# Altium schematic sheet Externos.SchDoc
size A4
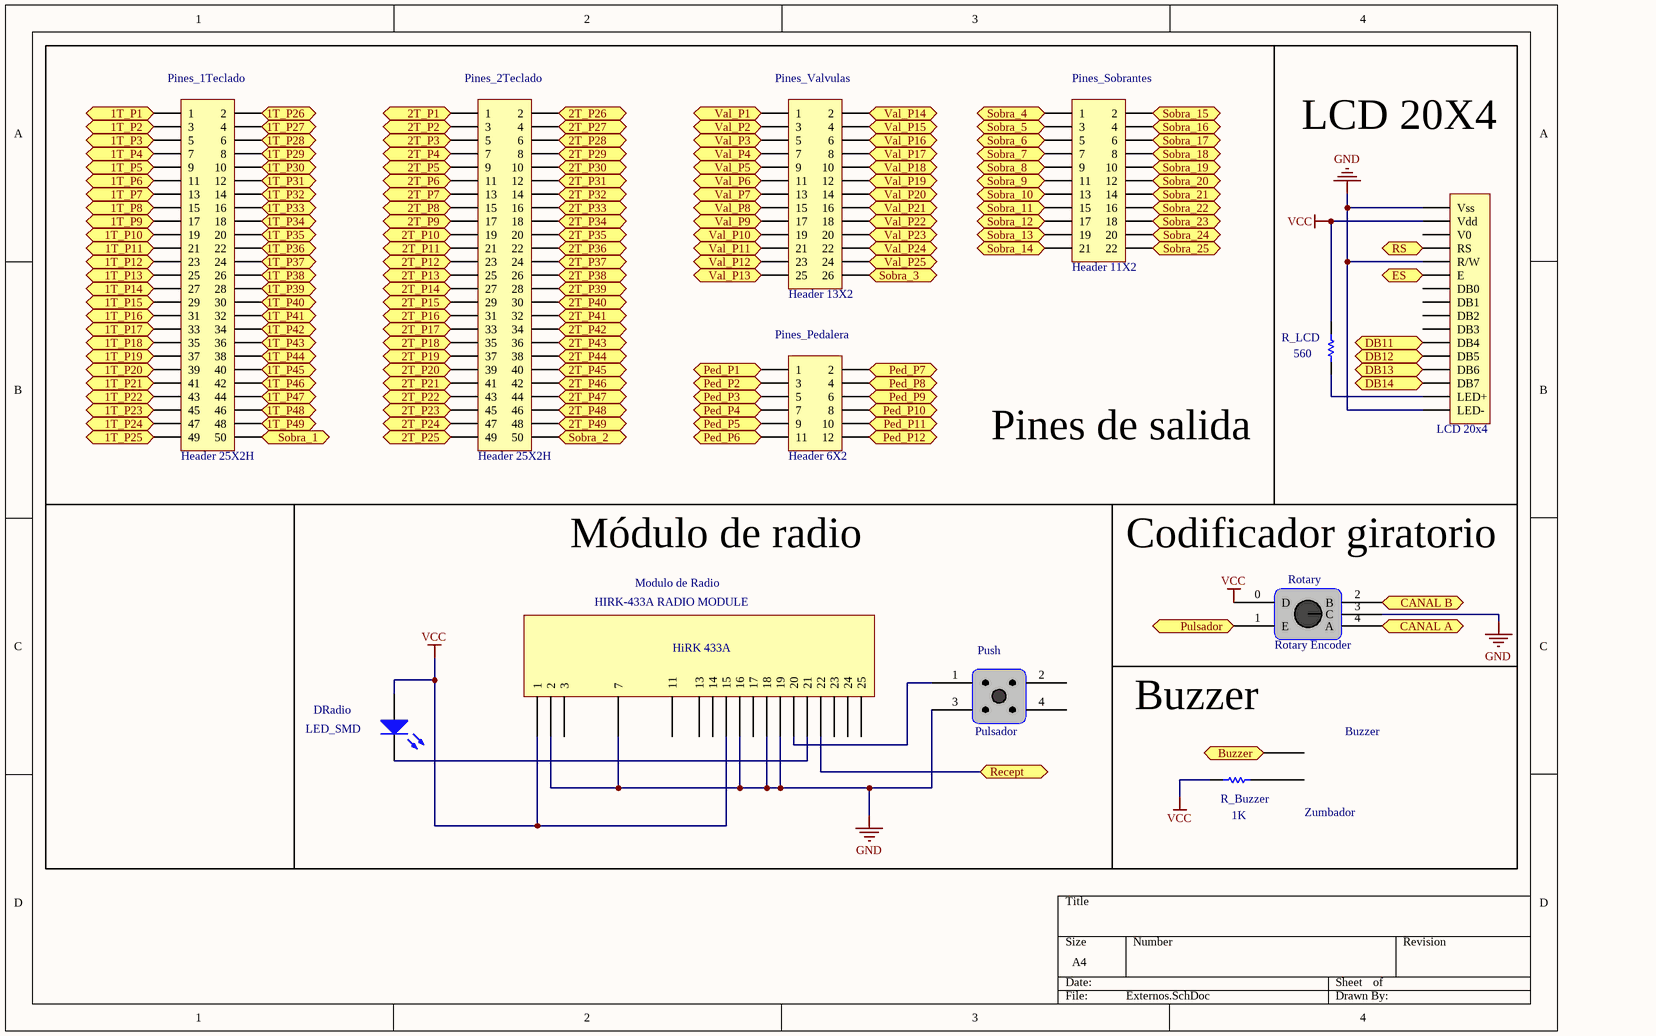
[diagram p0: Externos.SchDoc]

## Parts
?  Zumbador  [Buzzer]
DRadio  LED_SMD  [0805]
LCD_20x4  LCD 20x4  [LCD 4x20]  (value not drawn)
Modulo_de_Radio  HIRK-433A RADIO MODULE  [HIRK-433A RADIO MODULE]
Pines_1Teclado  Header 25X2H  [HDR2X25H]
Pines_2Teclado  Header 25X2H  [HDR2X25H]
Pines_Pedalera  Header 6X2  [HDR2X6]
Pines_Sobrantes  Header 11X2  [HDR2X11]
Pines_Valvulas  Header 13X2  [HDR2X13]
Push  Pulsador  [Pulsador]
R_Buzzer  value 1K  [0805 Chip Res]  (hidden comment: Res Chip 0805)
R_LCD  value 560  [0805 Chip Res]  (hidden comment: Res Chip 0805)
Rotary  Rotary Encoder  [RotaryPCB]

## Ports
1T_P1, 1T_P2, 1T_P3, 1T_P4, 1T_P5, 1T_P6, 1T_P7, 1T_P8, 1T_P9, 1T_P10, 1T_P11, 1T_P12, 1T_P13, 1T_P14, 1T_P15, 1T_P16, 1T_P17, 1T_P18, 1T_P19, 1T_P20, 1T_P21, 1T_P22, 1T_P23, 1T_P24, 1T_P25, 1T_P26, 1T_P27, 1T_P28, 1T_P29, 1T_P30, 1T_P31, 1T_P32, 1T_P33, 1T_P34, 1T_P35, 1T_P36, 1T_P37, 1T_P38, 1T_P39, 1T_P40, 1T_P41, 1T_P42, 1T_P43, 1T_P44, 1T_P45, 1T_P46, 1T_P47, 1T_P48, 1T_P49, 2T_P1, 2T_P2, 2T_P3, 2T_P4, 2T_P5, 2T_P6, 2T_P7, 2T_P8, 2T_P9, 2T_P10, 2T_P11, 2T_P12, 2T_P13, 2T_P14, 2T_P15, 2T_P16, 2T_P17, 2T_P18, 2T_P19, 2T_P20, 2T_P21, 2T_P22, 2T_P23, 2T_P24, 2T_P25, 2T_P26, 2T_P27, 2T_P28, 2T_P29, 2T_P30, 2T_P31, 2T_P32, 2T_P33, 2T_P34, 2T_P35, 2T_P36, 2T_P37, 2T_P38, 2T_P39, 2T_P40, 2T_P41, 2T_P42, 2T_P43, 2T_P44, 2T_P45, 2T_P46, 2T_P47, 2T_P48, 2T_P49, Buzzer, CANAL A, CANAL B, DB11, DB12, DB13, DB14, ES, Ped_P1, Ped_P2, Ped_P3, Ped_P4, Ped_P5, Ped_P6, Ped_P7, Ped_P8, Ped_P9, Ped_P10, Ped_P11, Ped_P12, Pulsador, Recept, RS, Sobra_1, Sobra_2, Sobra_3, Sobra_4, Sobra_5, Sobra_6, Sobra_7, Sobra_8, Sobra_9, Sobra_10, Sobra_11, Sobra_12, Sobra_13, Sobra_14, Sobra_15, Sobra_16, Sobra_17, Sobra_18, Sobra_19, Sobra_20, Sobra_21, Sobra_22, Sobra_23, Sobra_24, Sobra_25, Val_P1, Val_P2, Val_P3, Val_P4, Val_P5, Val_P6, Val_P7, Val_P8, Val_P9, Val_P10, Val_P11, Val_P12, Val_P13, Val_P14, Val_P15, Val_P16, Val_P17, Val_P18, Val_P19, Val_P20, Val_P21, Val_P22, Val_P23, Val_P24, Val_P25

## Nets
GND: LCD_20x4.1(Vss) LCD_20x4.5(R/W) LCD_20x4.16(LED-) Modulo_de_Radio.2 Modulo_de_Radio.7 Modulo_de_Radio.16 Modulo_de_Radio.18 Modulo_de_Radio.19 Push.3 Rotary.3(C)
VCC: DRadio.1(A) LCD_20x4.2(Vdd) Modulo_de_Radio.1 Modulo_de_Radio.15 R_Buzzer.2 R_LCD.2 Rotary.0(D)
1T_P1: Pines_1Teclado.1 ; port 1T_P1
1T_P2: Pines_1Teclado.3 ; port 1T_P2
1T_P3: Pines_1Teclado.5 ; port 1T_P3
1T_P4: Pines_1Teclado.7 ; port 1T_P4
1T_P5: Pines_1Teclado.9 ; port 1T_P5
1T_P6: Pines_1Teclado.11 ; port 1T_P6
1T_P7: Pines_1Teclado.13 ; port 1T_P7
1T_P8: Pines_1Teclado.15 ; port 1T_P8
1T_P9: Pines_1Teclado.17 ; port 1T_P9
1T_P10: Pines_1Teclado.19 ; port 1T_P10
1T_P11: Pines_1Teclado.21 ; port 1T_P11
1T_P12: Pines_1Teclado.23 ; port 1T_P12
1T_P13: Pines_1Teclado.25 ; port 1T_P13
1T_P14: Pines_1Teclado.27 ; port 1T_P14
1T_P15: Pines_1Teclado.29 ; port 1T_P15
1T_P16: Pines_1Teclado.31 ; port 1T_P16
1T_P17: Pines_1Teclado.33 ; port 1T_P17
1T_P18: Pines_1Teclado.35 ; port 1T_P18
1T_P19: Pines_1Teclado.37 ; port 1T_P19
1T_P20: Pines_1Teclado.39 ; port 1T_P20
1T_P21: Pines_1Teclado.41 ; port 1T_P21
1T_P22: Pines_1Teclado.43 ; port 1T_P22
1T_P23: Pines_1Teclado.45 ; port 1T_P23
1T_P24: Pines_1Teclado.47 ; port 1T_P24
1T_P25: Pines_1Teclado.49 ; port 1T_P25
1T_P26: Pines_1Teclado.2 ; port 1T_P26
1T_P27: Pines_1Teclado.4 ; port 1T_P27
1T_P28: Pines_1Teclado.6 ; port 1T_P28
1T_P29: Pines_1Teclado.8 ; port 1T_P29
1T_P30: Pines_1Teclado.10 ; port 1T_P30
1T_P31: Pines_1Teclado.12 ; port 1T_P31
1T_P32: Pines_1Teclado.14 ; port 1T_P32
1T_P33: Pines_1Teclado.16 ; port 1T_P33
1T_P34: Pines_1Teclado.18 ; port 1T_P34
1T_P35: Pines_1Teclado.20 ; port 1T_P35
1T_P36: Pines_1Teclado.22 ; port 1T_P36
1T_P37: Pines_1Teclado.24 ; port 1T_P37
1T_P38: Pines_1Teclado.26 ; port 1T_P38
1T_P39: Pines_1Teclado.28 ; port 1T_P39
1T_P40: Pines_1Teclado.30 ; port 1T_P40
1T_P41: Pines_1Teclado.32 ; port 1T_P41
1T_P42: Pines_1Teclado.34 ; port 1T_P42
1T_P43: Pines_1Teclado.36 ; port 1T_P43
1T_P44: Pines_1Teclado.38 ; port 1T_P44
1T_P45: Pines_1Teclado.40 ; port 1T_P45
1T_P46: Pines_1Teclado.42 ; port 1T_P46
1T_P47: Pines_1Teclado.44 ; port 1T_P47
1T_P48: Pines_1Teclado.46 ; port 1T_P48
1T_P49: Pines_1Teclado.48 ; port 1T_P49
2T_P1: Pines_2Teclado.1 ; port 2T_P1
2T_P2: Pines_2Teclado.3 ; port 2T_P2
2T_P3: Pines_2Teclado.5 ; port 2T_P3
2T_P4: Pines_2Teclado.7 ; port 2T_P4
2T_P5: Pines_2Teclado.9 ; port 2T_P5
2T_P6: Pines_2Teclado.11 ; port 2T_P6
2T_P7: Pines_2Teclado.13 ; port 2T_P7
2T_P8: Pines_2Teclado.15 ; port 2T_P8
2T_P9: Pines_2Teclado.17 ; port 2T_P9
2T_P10: Pines_2Teclado.19 ; port 2T_P10
2T_P11: Pines_2Teclado.21 ; port 2T_P11
2T_P12: Pines_2Teclado.23 ; port 2T_P12
2T_P13: Pines_2Teclado.25 ; port 2T_P13
2T_P14: Pines_2Teclado.27 ; port 2T_P14
2T_P15: Pines_2Teclado.29 ; port 2T_P15
2T_P16: Pines_2Teclado.31 ; port 2T_P16
2T_P17: Pines_2Teclado.33 ; port 2T_P17
2T_P18: Pines_2Teclado.35 ; port 2T_P18
2T_P19: Pines_2Teclado.37 ; port 2T_P19
2T_P20: Pines_2Teclado.39 ; port 2T_P20
2T_P21: Pines_2Teclado.41 ; port 2T_P21
2T_P22: Pines_2Teclado.43 ; port 2T_P22
2T_P23: Pines_2Teclado.45 ; port 2T_P23
2T_P24: Pines_2Teclado.47 ; port 2T_P24
2T_P25: Pines_2Teclado.49 ; port 2T_P25
2T_P26: Pines_2Teclado.2 ; port 2T_P26
2T_P27: Pines_2Teclado.4 ; port 2T_P27
2T_P28: Pines_2Teclado.6 ; port 2T_P28
2T_P29: Pines_2Teclado.8 ; port 2T_P29
2T_P30: Pines_2Teclado.10 ; port 2T_P30
2T_P31: Pines_2Teclado.12 ; port 2T_P31
2T_P32: Pines_2Teclado.14 ; port 2T_P32
2T_P33: Pines_2Teclado.16 ; port 2T_P33
2T_P34: Pines_2Teclado.18 ; port 2T_P34
2T_P35: Pines_2Teclado.20 ; port 2T_P35
2T_P36: Pines_2Teclado.22 ; port 2T_P36
2T_P37: Pines_2Teclado.24 ; port 2T_P37
2T_P38: Pines_2Teclado.26 ; port 2T_P38
2T_P39: Pines_2Teclado.28 ; port 2T_P39
2T_P40: Pines_2Teclado.30 ; port 2T_P40
2T_P41: Pines_2Teclado.32 ; port 2T_P41
2T_P42: Pines_2Teclado.34 ; port 2T_P42
2T_P43: Pines_2Teclado.36 ; port 2T_P43
2T_P44: Pines_2Teclado.38 ; port 2T_P44
2T_P45: Pines_2Teclado.40 ; port 2T_P45
2T_P46: Pines_2Teclado.42 ; port 2T_P46
2T_P47: Pines_2Teclado.44 ; port 2T_P47
2T_P48: Pines_2Teclado.46 ; port 2T_P48
2T_P49: Pines_2Teclado.48 ; port 2T_P49
Buzzer: ?.0 ; port Buzzer
CANAL A: Rotary.4(A) ; port CANAL A
CANAL B: Rotary.2(B) ; port CANAL B
DB11: LCD_20x4.11(DB4) ; port DB11
DB12: LCD_20x4.12(DB5) ; port DB12
DB13: LCD_20x4.13(DB6) ; port DB13
DB14: LCD_20x4.14(DB7) ; port DB14
ES: LCD_20x4.6(E) ; port ES
Ped_P1: Pines_Pedalera.1 ; port Ped_P1
Ped_P2: Pines_Pedalera.3 ; port Ped_P2
Ped_P3: Pines_Pedalera.5 ; port Ped_P3
Ped_P4: Pines_Pedalera.7 ; port Ped_P4
Ped_P5: Pines_Pedalera.9 ; port Ped_P5
Ped_P6: Pines_Pedalera.11 ; port Ped_P6
Ped_P7: Pines_Pedalera.2 ; port Ped_P7
Ped_P8: Pines_Pedalera.4 ; port Ped_P8
Ped_P9: Pines_Pedalera.6 ; port Ped_P9
Ped_P10: Pines_Pedalera.8 ; port Ped_P10
Ped_P11: Pines_Pedalera.10 ; port Ped_P11
Ped_P12: Pines_Pedalera.12 ; port Ped_P12
Pulsador: Rotary.1(E) ; port Pulsador
Recept: Modulo_de_Radio.22 ; port Recept
RS: LCD_20x4.4(RS) ; port RS
Sobra_1: Pines_1Teclado.50 ; port Sobra_1
Sobra_2: Pines_2Teclado.50 ; port Sobra_2
Sobra_3: Pines_Valvulas.26 ; port Sobra_3
Sobra_4: Pines_Sobrantes.1 ; port Sobra_4
Sobra_5: Pines_Sobrantes.3 ; port Sobra_5
Sobra_6: Pines_Sobrantes.5 ; port Sobra_6
Sobra_7: Pines_Sobrantes.7 ; port Sobra_7
Sobra_8: Pines_Sobrantes.9 ; port Sobra_8
Sobra_9: Pines_Sobrantes.11 ; port Sobra_9
Sobra_10: Pines_Sobrantes.13 ; port Sobra_10
Sobra_11: Pines_Sobrantes.15 ; port Sobra_11
Sobra_12: Pines_Sobrantes.17 ; port Sobra_12
Sobra_13: Pines_Sobrantes.19 ; port Sobra_13
Sobra_14: Pines_Sobrantes.21 ; port Sobra_14
Sobra_15: Pines_Sobrantes.2 ; port Sobra_15
Sobra_16: Pines_Sobrantes.4 ; port Sobra_16
Sobra_17: Pines_Sobrantes.6 ; port Sobra_17
Sobra_18: Pines_Sobrantes.8 ; port Sobra_18
Sobra_19: Pines_Sobrantes.10 ; port Sobra_19
Sobra_20: Pines_Sobrantes.12 ; port Sobra_20
Sobra_21: Pines_Sobrantes.14 ; port Sobra_21
Sobra_22: Pines_Sobrantes.16 ; port Sobra_22
Sobra_23: Pines_Sobrantes.18 ; port Sobra_23
Sobra_24: Pines_Sobrantes.20 ; port Sobra_24
Sobra_25: Pines_Sobrantes.22 ; port Sobra_25
Val_P1: Pines_Valvulas.1 ; port Val_P1
Val_P2: Pines_Valvulas.3 ; port Val_P2
Val_P3: Pines_Valvulas.5 ; port Val_P3
Val_P4: Pines_Valvulas.7 ; port Val_P4
Val_P5: Pines_Valvulas.9 ; port Val_P5
Val_P6: Pines_Valvulas.11 ; port Val_P6
Val_P7: Pines_Valvulas.13 ; port Val_P7
Val_P8: Pines_Valvulas.15 ; port Val_P8
Val_P9: Pines_Valvulas.17 ; port Val_P9
Val_P10: Pines_Valvulas.19 ; port Val_P10
Val_P11: Pines_Valvulas.21 ; port Val_P11
Val_P12: Pines_Valvulas.23 ; port Val_P12
Val_P13: Pines_Valvulas.25 ; port Val_P13
Val_P14: Pines_Valvulas.2 ; port Val_P14
Val_P15: Pines_Valvulas.4 ; port Val_P15
Val_P16: Pines_Valvulas.6 ; port Val_P16
Val_P17: Pines_Valvulas.8 ; port Val_P17
Val_P18: Pines_Valvulas.10 ; port Val_P18
Val_P19: Pines_Valvulas.12 ; port Val_P19
Val_P20: Pines_Valvulas.14 ; port Val_P20
Val_P21: Pines_Valvulas.16 ; port Val_P21
Val_P22: Pines_Valvulas.18 ; port Val_P22
Val_P23: Pines_Valvulas.20 ; port Val_P23
Val_P24: Pines_Valvulas.22 ; port Val_P24
Val_P25: Pines_Valvulas.24 ; port Val_P25
Net?_1: ?.1 R_Buzzer.1
NetDRadio_2: DRadio.2(K) Modulo_de_Radio.21
NetLCD_20x4_15: LCD_20x4.15(LED+) R_LCD.1
NetModulo_de_Radio_20: Modulo_de_Radio.20 Push.1

Not connected (* = marked no-connect by the designer): LCD_20x4 3(V0) 7(DB0) 8(DB1) 9(DB2) 10(DB3); Modulo_de_Radio 3 11 13 14 17 23 24 25; Push 2 4

## Notes on the sheet
- LCD 20X4
- (near R_LCD) Pines de salida
- Módulo de radio
- (near Rotary) Codificador giratorio
- Buzzer
- (in symbol HIRK-433A RADIO MODULE) HiRK 433A

## Library data of the parts
? = Buzzer
DRadio = LED_SMD: LED SMD; Published: 8-Jun-2000; LatestRevisionDate: 08-Jul-2005; LatestRevisionNote: Mech Layer 1 removed.; PackageReference: LED-0; Publisher: Altium Limited
Pines_1Teclado Pines_2Teclado = Header 25X2H: Header, 25-Pin, Dual row, Right Angle; LatestRevisionDate: 17-Jul-2002; LatestRevisionNote: Re-released for DXP Platform.; Publisher: Altium Limited
Pines_Pedalera = Header 6X2: Header, 6-Pin, Dual row; LatestRevisionDate: 17-Jul-2002; LatestRevisionNote: Re-released for DXP Platform.; Publisher: Altium Limited
Pines_Sobrantes = Header 11X2: Header, 11-Pin, Dual row; LatestRevisionDate: 17-Jul-2002; LatestRevisionNote: Re-released for DXP Platform.; Publisher: Altium Limited
Pines_Valvulas = Header 13X2: Header, 13-Pin, Dual row; LatestRevisionDate: 17-Jul-2002; LatestRevisionNote: Re-released for DXP Platform.; Publisher: Altium Limited
R_Buzzer R_LCD = Resistencia: Published: 8-Jun-2000; LatestRevisionDate: 17-Jul-2002; LatestRevisionNote: Re-released for DXP Platform.; PackageReference: AXIAL-0.3; Publisher: Altium Limited; PackageDescription: Axial Device, Thru-Hole; 2 Leads; 0.3 in Pin Spacing
Rotary = Rotary Encoder: pin to pad: 0>D 1>E 2>B 3>C 4>A
LCD_20x4 = LCD 20x4: LatestRevisionDate: 17-Jul-2002; LatestRevisionNote: Re-released for DXP Platform.; Publisher: Altium Limited